# Altium project Open Reactor Control System.PrjPcb (part 1 of 2)
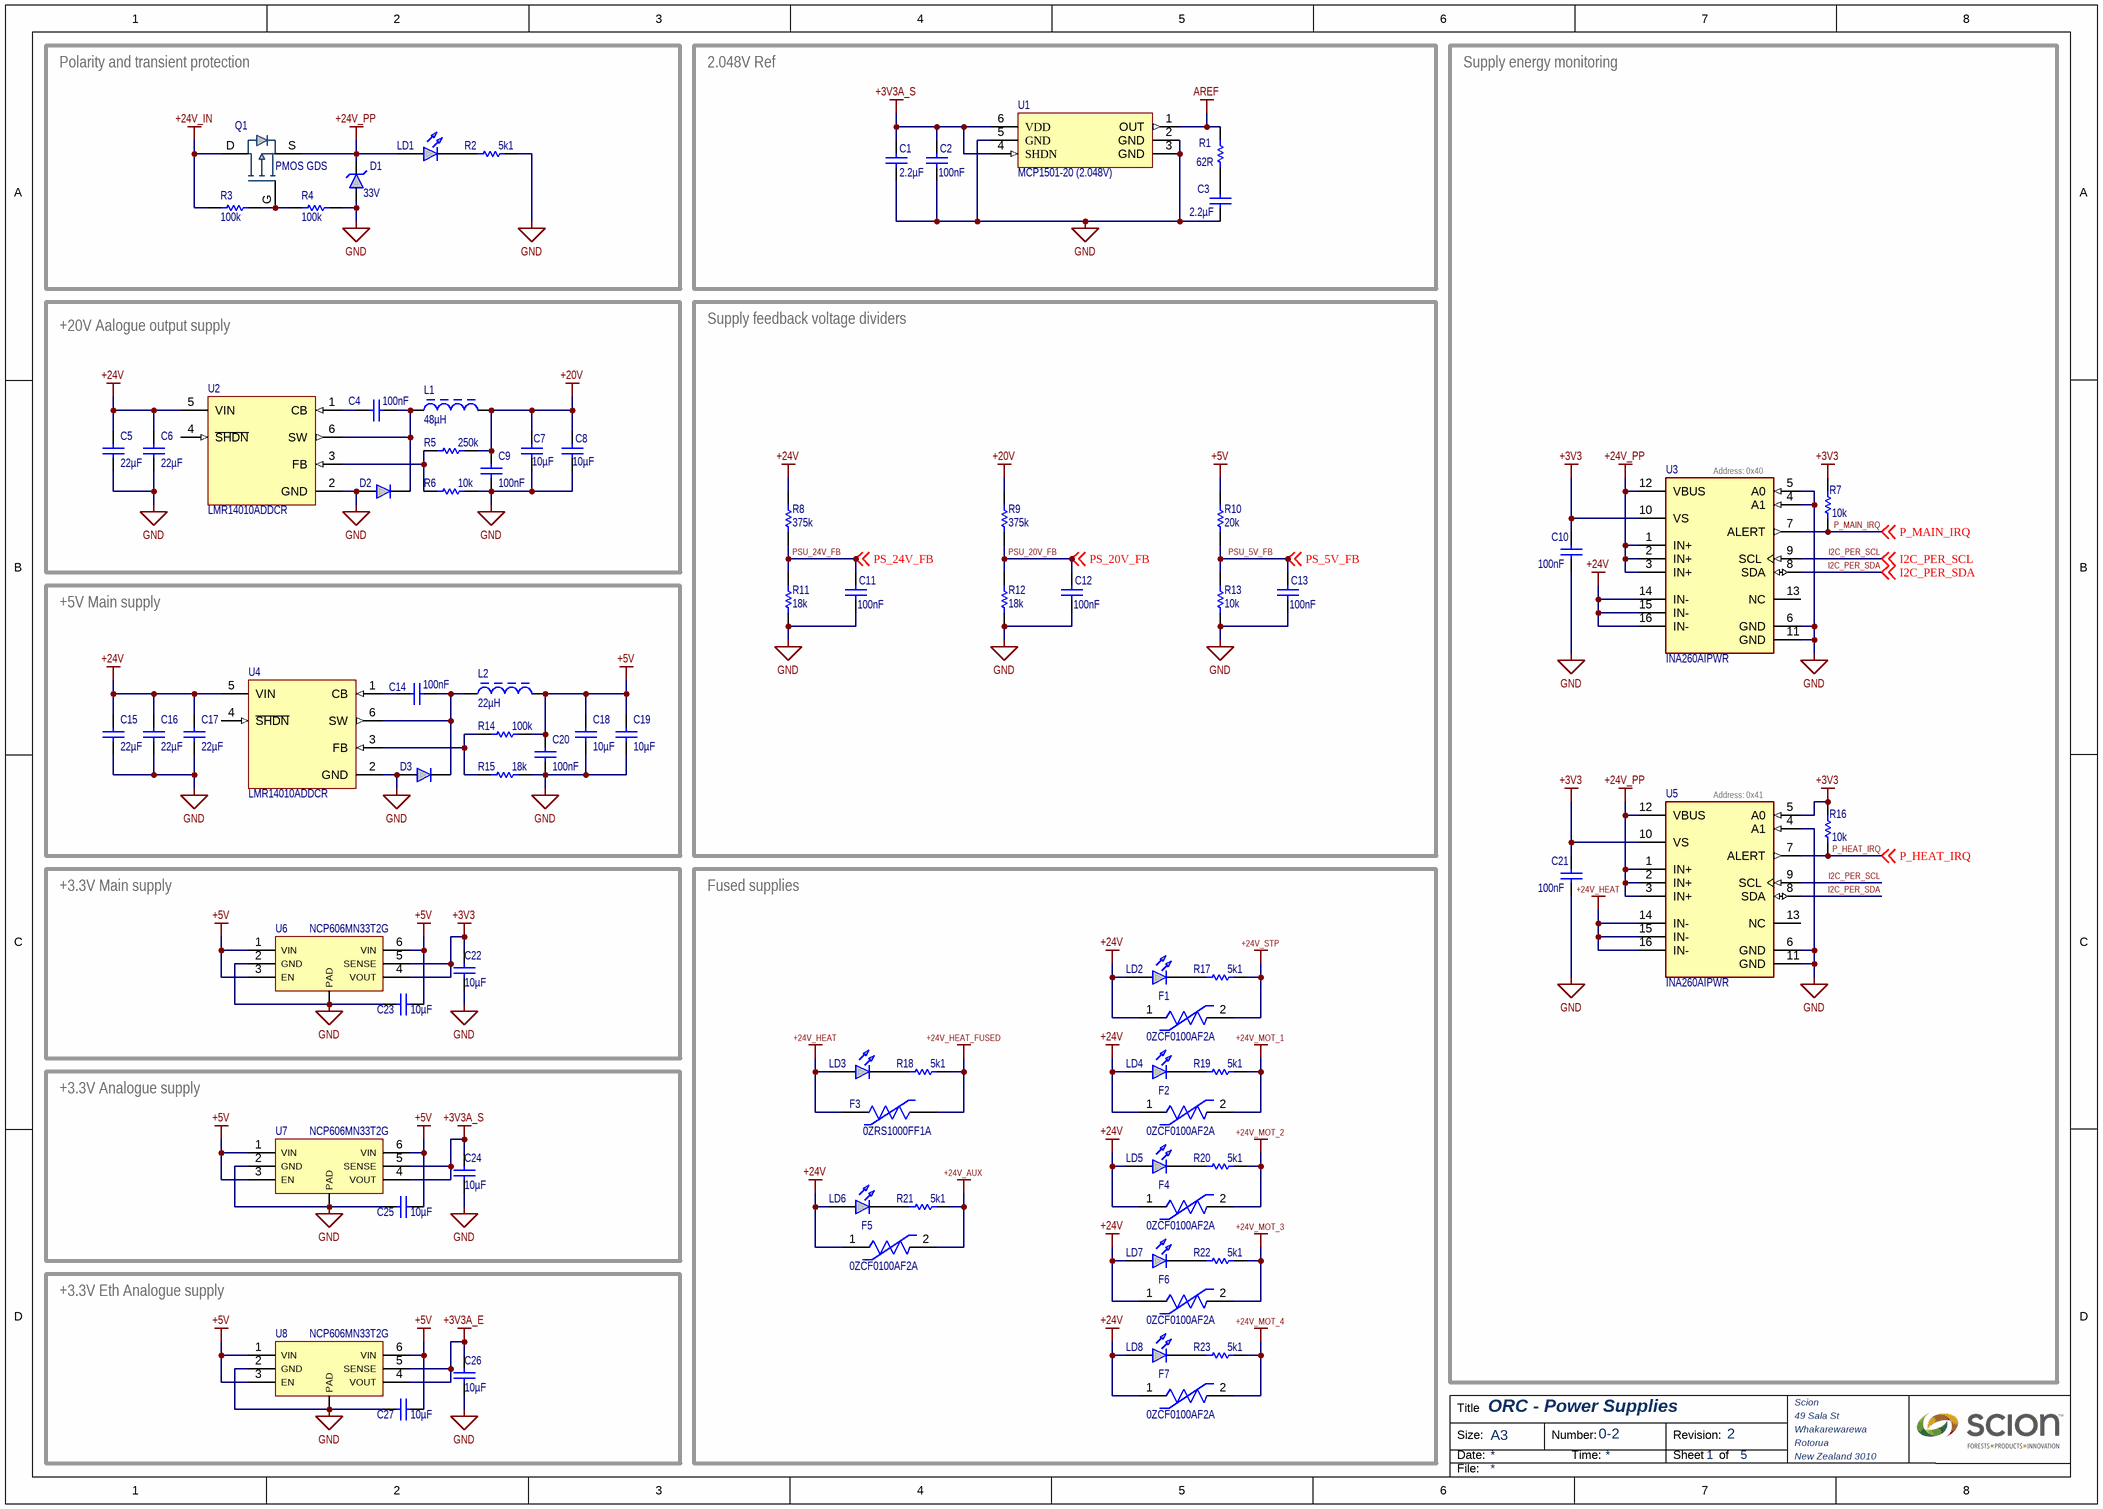
[diagram p0: Open Reactor Control System - Power Supplies.SchDoc]
5 sheets, 408 parts. Net scope: global (net labels, ports and power ports of the same name join across sheets).
Board file: Open Reactor Control System.PcbDoc
Sheets:
  Open Reactor Control System - Power Supplies.SchDoc
  Open Reactor Control System - System Interface MCU.SchDoc
  Open Reactor Control System - Machine Interface MCU.SchDoc
  Open Reactor Control System - Analogue & IO Interfaces.SchDoc
  Open Reactor Control System - IO Connections.SchDoc

## Sheet Open Reactor Control System - Power Supplies.SchDoc: ORC - Power Supplies
size A3; Author: Peake J; CompanyName: Scion Research; DrawnBy: Peake J; Engineer: Peake J; Organization: Scion; Address1: 49 Sala St; Address2: Whakarewarewa; Address3: Rotorua; Address4: New Zealand 3010; DocumentNumber: 0-2; Revision: 2; SheetNumber: 1; SheetTotal: 5

### Parts
C1  value 2.2µF  [0603_CAP]  (hidden comment: Capacitor)
C2  value 100nF  [0603_CAP]  (hidden comment: Capacitor)
C3  value 2.2µF  [0603_CAP]  (hidden comment: Capacitor)
C4  value 100nF  [0603_CAP]  (hidden comment: Capacitor)
C5  value 22µF  [1206_CAP]  (hidden comment: Capacitor)
C6  value 22µF  [1206_CAP]  (hidden comment: Capacitor)
C7  value 10µF  [1206_CAP]  (hidden comment: Capacitor)
C8  value 10µF  [1206_CAP]  (hidden comment: Capacitor)
C9  value 100nF  [0603_CAP]  (hidden comment: Capacitor)
C10  value 100nF  [0603_CAP]  (hidden comment: Capacitor)
C11  value 100nF  [0603_CAP]  (hidden comment: Capacitor)
C12  value 100nF  [0603_CAP]  (hidden comment: Capacitor)
C13  value 100nF  [0603_CAP]  (hidden comment: Capacitor)
C14  value 100nF  [0603_CAP]  (hidden comment: Capacitor)
C15  value 22µF  [1206_CAP]  (hidden comment: Capacitor)
C16  value 22µF  [1206_CAP]  (hidden comment: Capacitor)
C17  value 22µF  [1206_CAP]  (hidden comment: Capacitor)
C18  value 10µF  [0603_CAP]  (hidden comment: Capacitor)
C19  value 10µF  [0603_CAP]  (hidden comment: Capacitor)
C20  value 100nF  [0603_CAP]  (hidden comment: Capacitor)
C21  value 100nF  [0603_CAP]  (hidden comment: Capacitor)
C22  value 10µF  [0603_CAP]  (hidden comment: Capacitor)
C23  value 10µF  [0603_CAP]  (hidden comment: Capacitor)
C24  value 10µF  [0603_CAP]  (hidden comment: Capacitor)
C25  value 10µF  [0603_CAP]  (hidden comment: Capacitor)
C26  value 10µF  [0603_CAP]  (hidden comment: Capacitor)
C27  value 10µF  [0603_CAP]  (hidden comment: Capacitor)
D1  Rated Voltage: 33V  [SMBJ]  (hidden comment: Transil)
D2  Diode  [SOD-123]  (value not drawn)
D3  Diode  [SOD-123]  (value not drawn)
F1  0ZCF0100AF2A  [FP-0ZCF0100AF2A-MFG]
F2  0ZCF0100AF2A  [FP-0ZCF0100AF2A-MFG]
F3  0ZRS1000FF1A  [0ZRS1000FF1A-flat]
F4  0ZCF0100AF2A  [FP-0ZCF0100AF2A-MFG]
F5  0ZCF0100AF2A  [FP-0ZCF0100AF2A-MFG]
F6  0ZCF0100AF2A  [FP-0ZCF0100AF2A-MFG]
F7  0ZCF0100AF2A  [FP-0ZCF0100AF2A-MFG]
L1  value 48µH  [SRR1206]  (hidden comment: Inductor)
L2  value 22µH  [BOUR-SRN8040_V]  (hidden comment: Inductor)
LD1  LED  [0805]  (value not drawn)
LD2  LED  [0805]  (value not drawn)
LD3  LED  [0805]  (value not drawn)
LD4  LED  [0805]  (value not drawn)
LD5  LED  [0805]  (value not drawn)
LD6  LED  [0805]  (value not drawn)
LD7  LED  [0805]  (value not drawn)
LD8  LED  [0805]  (value not drawn)
Q1  PMOS GDS  [PowerDI 5060-8]
R1  value 62R  [0603_RES]  (hidden comment: Resistor)
R2  value 5k1  [0603_RES]  (hidden comment: Resistor)
R3  value 100k  [0603_RES]  (hidden comment: Resistor)
R4  value 100k  [0603_RES]  (hidden comment: Resistor)
R5  value 250k  [0603_RES]  (hidden comment: Resistor)
R6  value 10k  [0603_RES]  (hidden comment: Resistor)
R7  value 10k  [0603_RES]  (hidden comment: Resistor)
R8  value 375k  [0603_RES]  (hidden comment: Resistor)
R9  value 375k  [0603_RES]  (hidden comment: Resistor)
R10  value 20k  [0603_RES]  (hidden comment: Resistor)
R11  value 18k  [0603_RES]  (hidden comment: Resistor)
R12  value 18k  [0603_RES]  (hidden comment: Resistor)
R13  value 10k  [0603_RES]  (hidden comment: Resistor)
R14  value 100k  [0603_RES]  (hidden comment: Resistor)
R15  value 18k  [0603_RES]  (hidden comment: Resistor)
R16  value 10k  [0603_RES]  (hidden comment: Resistor)
R17  value 5k1  [0603_RES]  (hidden comment: Resistor)
R18  value 5k1  [0603_RES]  (hidden comment: Resistor)
R19  value 5k1  [0603_RES]  (hidden comment: Resistor)
R20  value 5k1  [0603_RES]  (hidden comment: Resistor)
R21  value 5k1  [0603_RES]  (hidden comment: Resistor)
R22  value 5k1  [0603_RES]  (hidden comment: Resistor)
R23  value 5k1  [0603_RES]  (hidden comment: Resistor)
U1  MCP1501-20 (2.048V)  [SOT-6]
U2  LMR14010ADDCR  [FP-DDC0006A-IPC_A]
U3  INA260AIPWR  [FP-PW0016A-IPC_B]
U4  LMR14010ADDCR  [FP-DDC0006A-IPC_A]
U5  INA260AIPWR  [FP-PW0016A-IPC_B]
U6  NCP606MN33T2G  [QFN95P330X295X100_HS-7N]
U7  NCP606MN33T2G  [QFN95P330X295X100_HS-7N]
U8  NCP606MN33T2G  [QFN95P330X295X100_HS-7N]

### Blocks framed on the sheet
Polarity and transient protection: D1 LD1 Q1 R2-R4
2.048V Ref: C1-C3 R1 U1
Supply energy monitoring: C10 C21 R7 R16 U3 U5
+20V Aalogue output supply: C4-C9 D2 L1 R5 R6 U2
Supply feedback voltage dividers: C11-C13 R8-R13
+5V Main supply: C14-C20 D3 L2 R14 R15 U4
+3.3V Main supply: C22 C23 U6
Fused supplies: F1-F7 LD2-LD8 R17-R23
+3.3V Analogue supply: C24 C25 U7
+3.3V Eth Analogue supply: C26 C27 U8

### Nets
+3V3: C10.1 C21.1 C22.1 R7.1 R16.1 U3.10(VS) U5.5(A0) U5.10(VS) U6.4(VOUT) U6.5(SENSE)
+3V3A_E: C26.1 U8.4(VOUT) U8.5(SENSE)
+3V3A_S: C1.1 C2.1 C24.1 U1.4(SHDN) U1.6(VDD) U7.4(VOUT) U7.5(SENSE)
+5V: C18.1 C19.1 C20.1 C23.1 C25.1 C27.1 L2.2 R10.1 R14.2 U6.1(VIN) U6.3(EN) U6.6(VIN) U7.1(VIN) U7.3(EN) U7.6(VIN) U8.1(VIN) U8.3(EN) U8.6(VIN)
+20V: C7.1 C8.1 C9.1 L1.2 R5.2 R9.1
+24V: C5.1 C6.1 C15.1 C16.1 C17.1 F1.1 F2.1 F4.1 F5.1 F6.1 F7.1 LD2.2(A) LD4.2(A) LD5.2(A) LD6.2(A) LD7.2(A) LD8.2(A) R8.1 U2.5(VIN) U3.14(IN-) U3.15(IN-) U3.16(IN-) U4.5(VIN)
+24V_AUX: F5.2 R21.2
+24V_HEAT: F3.1 LD3.2(A) U5.14(IN-) U5.15(IN-) U5.16(IN-)
+24V_HEAT_FUSED: F3.2 R18.2
+24V_IN: Q1.D R3.1
+24V_MOT_1: F2.2 R19.2
+24V_MOT_2: F4.2 R20.2
+24V_MOT_3: F6.2 R22.2
+24V_MOT_4: F7.2 R23.2
+24V_PP: D1.2(K) LD1.2(A) Q1.S U3.1(IN+) U3.2(IN+) U3.3(IN+) U3.12(VBUS) U5.1(IN+) U5.2(IN+) U5.3(IN+) U5.12(VBUS)
+24V_STP: F1.2 R17.2
AREF: R1.1 U1.1(OUT)
GND: C1.2 C2.2 C3.1 C5.2 C6.2 C7.2 C8.2 C9.2 C10.2 C11.2 C12.2 C13.2 C15.2 C16.2 C17.2 C18.2 C19.2 C20.2 C21.2 C22.2 C23.2 C24.2 C25.2 C26.2 C27.2 D1.1(A) D2.2(A) D3.2(A) R2.2 R4.2 R6.2 R11.1 R12.1 R13.1 R15.2 U1.2(GND) U1.3(GND) U1.5(GND) U2.2(GND) U3.4(A1) U3.5(A0) U3.6(GND) U3.11(GND) U4.2(GND) U5.4(A1) U5.6(GND) U5.11(GND) U6.2(GND) U6.PAD U7.2(GND) U7.PAD U8.2(GND) U8.PAD
I2C_PER_SCL: U3.9(SCL) U5.9(SCL) ; off-sheet I2C_PER_SCL
I2C_PER_SDA: U3.8(SDA) U5.8(SDA) ; off-sheet I2C_PER_SDA
P_HEAT_IRQ: R16.2 U5.7(ALERT) ; off-sheet P_HEAT_IRQ
P_MAIN_IRQ: R7.2 U3.7(ALERT) ; off-sheet P_MAIN_IRQ
PS_5V_FB: C13.1 R10.2 R13.2 ; off-sheet PS_5V_FB  [also labelled PSU_5V_FB]
PS_20V_FB: C12.1 R9.2 R12.2 ; off-sheet PS_20V_FB  [also labelled PSU_20V_FB]
PS_24V_FB: C11.1 R8.2 R11.2 ; off-sheet PS_24V_FB  [also labelled PSU_24V_FB]
NetC3_2: C3.2 R1.2
NetC4_1: C4.1 D2.1(K) L1.1 U2.6(SW)
NetC4_2: C4.2 U2.1(CB)
NetC14_1: C14.1 D3.1(K) L2.1 U4.6(SW)
NetC14_2: C14.2 U4.1(CB)
NetLD1_1: LD1.1(K) R2.1
NetLD2_1: LD2.1(K) R17.1
NetLD3_1: LD3.1(K) R18.1
NetLD4_1: LD4.1(K) R19.1
NetLD5_1: LD5.1(K) R20.1
NetLD6_1: LD6.1(K) R21.1
NetLD7_1: LD7.1(K) R22.1
NetLD8_1: LD8.1(K) R23.1
NetQ1_G: Q1.G R3.2 R4.1
NetR5_1: R5.1 R6.1 U2.3(FB)
NetR14_1: R14.1 R15.1 U4.3(FB)

Not connected (* = marked no-connect by the designer): U2 4(~{SHDN}); U3 13(NC); U4 4(~{SHDN}); U5 13(NC)

### Notes on the sheet
- (near U3) Address: 0x40
- (near U5) Address: 0x41
- Title
- Size:
- Date:
- A3
- Number:
- Time:
- Revision:
- Sheet
- of
- File:

### Library data of the parts
C1-C27 = CMP-001-00172-2: SMD Capacitor; Pins: 2; Source: Discrete.SchLib; Design Item ID: Capacitor; Component Type: Standard
D1 = CMP-079-000108-2: Transient Voltage Suppressor; MFN: SMBJ33A; Component Type: Standard; Pin Count: 2; Source: Discrete.SchLib; Breakdown Voltage: *; Design Item ID: Transil; Clamping Voltage: *
D2 D3 = CMP-004-00083-4: SMD Diode; Design Item ID: Diode; Pins: 2; Source: Discrete.SchLib; Component Type: Standard; Pin Count: 2
F1 F2 F4-F7 = CMP-005-00014-2: PTC Resettable Fuse 100A 0.5s 60VDC 0.09 Ohm 2-Pin 2920 T/R; Time to Trip: 500ms; Hold Current: 1A; Trip Current: 2A; Pins: 2; Component Type: Standard; Thickness: 0.067inch; Width: 0.202inch; Series: 0ZCF; Max Operating Temperature: 85°C; Source: All Components - 30.06.23 - 18.27.SchLib; Min Operating Temperature: -40°C; Design Item ID: CMP-00051-1; Length: 0.29inch; Case/Package: 2920; RoHS Compliant: Yes; Packaging: Cut Tape; Max Current Rating: 100A; Case Code (Metric): 7351; Mount: Surface Mount
F3 = CMP-005-00013-5: PTC Resettable Fuse 10A(hold) 20A(trip) 32VDC 100A 7W 15s 0.006Ohm Radial 23.5 X 4 X 27.9mm Box; Mount: Through Hole; Source: All Components - 30.06.23 - 18.27.SchLib; Trip Current: 20A; Component Type: Standard; Hold Current: 10A; Case/Package: Radial; Series: 0ZRS; Ratings: AEC-Q200; Time to Trip: 15s; Design Item ID: CMP-00049-1; Max Current Rating: 100A; Min Operating Temperature: -40°C; Pins: 2; Max Operating Temperature: 125°C
L1 L2 = CMP-006-00052-2: Power Inductor; DCR: 100mR; Current Rating: 2.2A; Pins: 2; Component Type: Standard; Design Item ID: Inductor; Source: Discrete.SchLib; Pin Count: 2; MFN: *
LD1-LD8 = CMP-004-00084-3: SMD LED; Colour: RED; Pins: 2; Source: Discrete.SchLib; Design Item ID: LED; Component Type: Standard; Pin Count: 2
Q1 = CMP-079-000102-2: P Channel MOSFET; MFN: *; Design Item ID: PMOS GDS; VGS Max: *; Continuous Current: *; VDS Breakdown: *; Source: P-MOS.SchLib; Component Type: Standard; Pin Count: 3
R1-R23 = CMP-009-00356-1: SMD Resistor; Pins: 2; Source: Discrete.SchLib; Component Type: Standard; Design Item ID: Resistor
U1 = CMP-079-000089-1: Voltage Reference; Pin Count: 6; Source: Microchip.SchLib; Component Type: Standard; Design Item ID: MCP1501
U2 U4 = CMP-079-000005-5: 7-40VDC-DC buck converter; Number of Outputs: 1; Max Output Voltage: 40V; Output Current: 1A; Min Input Voltage: 4V; Output Type: Adjustable; Synchronous Rectifier: No; Min Output Voltage: 765mV; Output Configuration: Positive; Switching Frequency: 850kHz; Max Operating Temperature: 125°C; Case/Package: SOT-23-6; Features: UVLO; Pin Count: 6; Packaging: Cut Tape; Mount: Surface Mount; Component Type: Standard; Min Operating Temperature: -40°C; Max Input Voltage: 40V; Source: All Components - 30.06.23 - 18.27.SchLib; Design Item ID: CMP-00007-1
U3 U5 = CMP-010-00002-1: Operational Amplifier, 1 Func, 7500uV Offset-Max, PDSO16; Max Supply Voltage: 5.5V; Nominal Supply Voltage: 3.3V; Min Supply Voltage: 2.7V; Case/Package: TSSOP; RoHS Compliant: Yes; Pins: 16; Max Operating Temperature: 125°C; Min Operating Temperature: -40°C
U6-U8 = CMP-019-00001-1: Fixed Positive LDO Regulator, 3.3V, 0.22V Dropout, CMOS; Max Supply Voltage: 6V; RoHS Compliant: Yes; Case/Package: HVSON; Pins: 6

## Sheet Open Reactor Control System - System Interface MCU.SchDoc: ORC - System Interface MCU
size A3; Author: Peake J; CompanyName: Scion Research; DrawnBy: Peake J; Engineer: Peake J; Organization: Scion; Address1: 49 Sala St; Address2: Whakarewarewa; Address3: Rotorua; Address4: New Zealand 3010; DocumentNumber: 0-3; Revision: 2; SheetNumber: 2; SheetTotal: 5
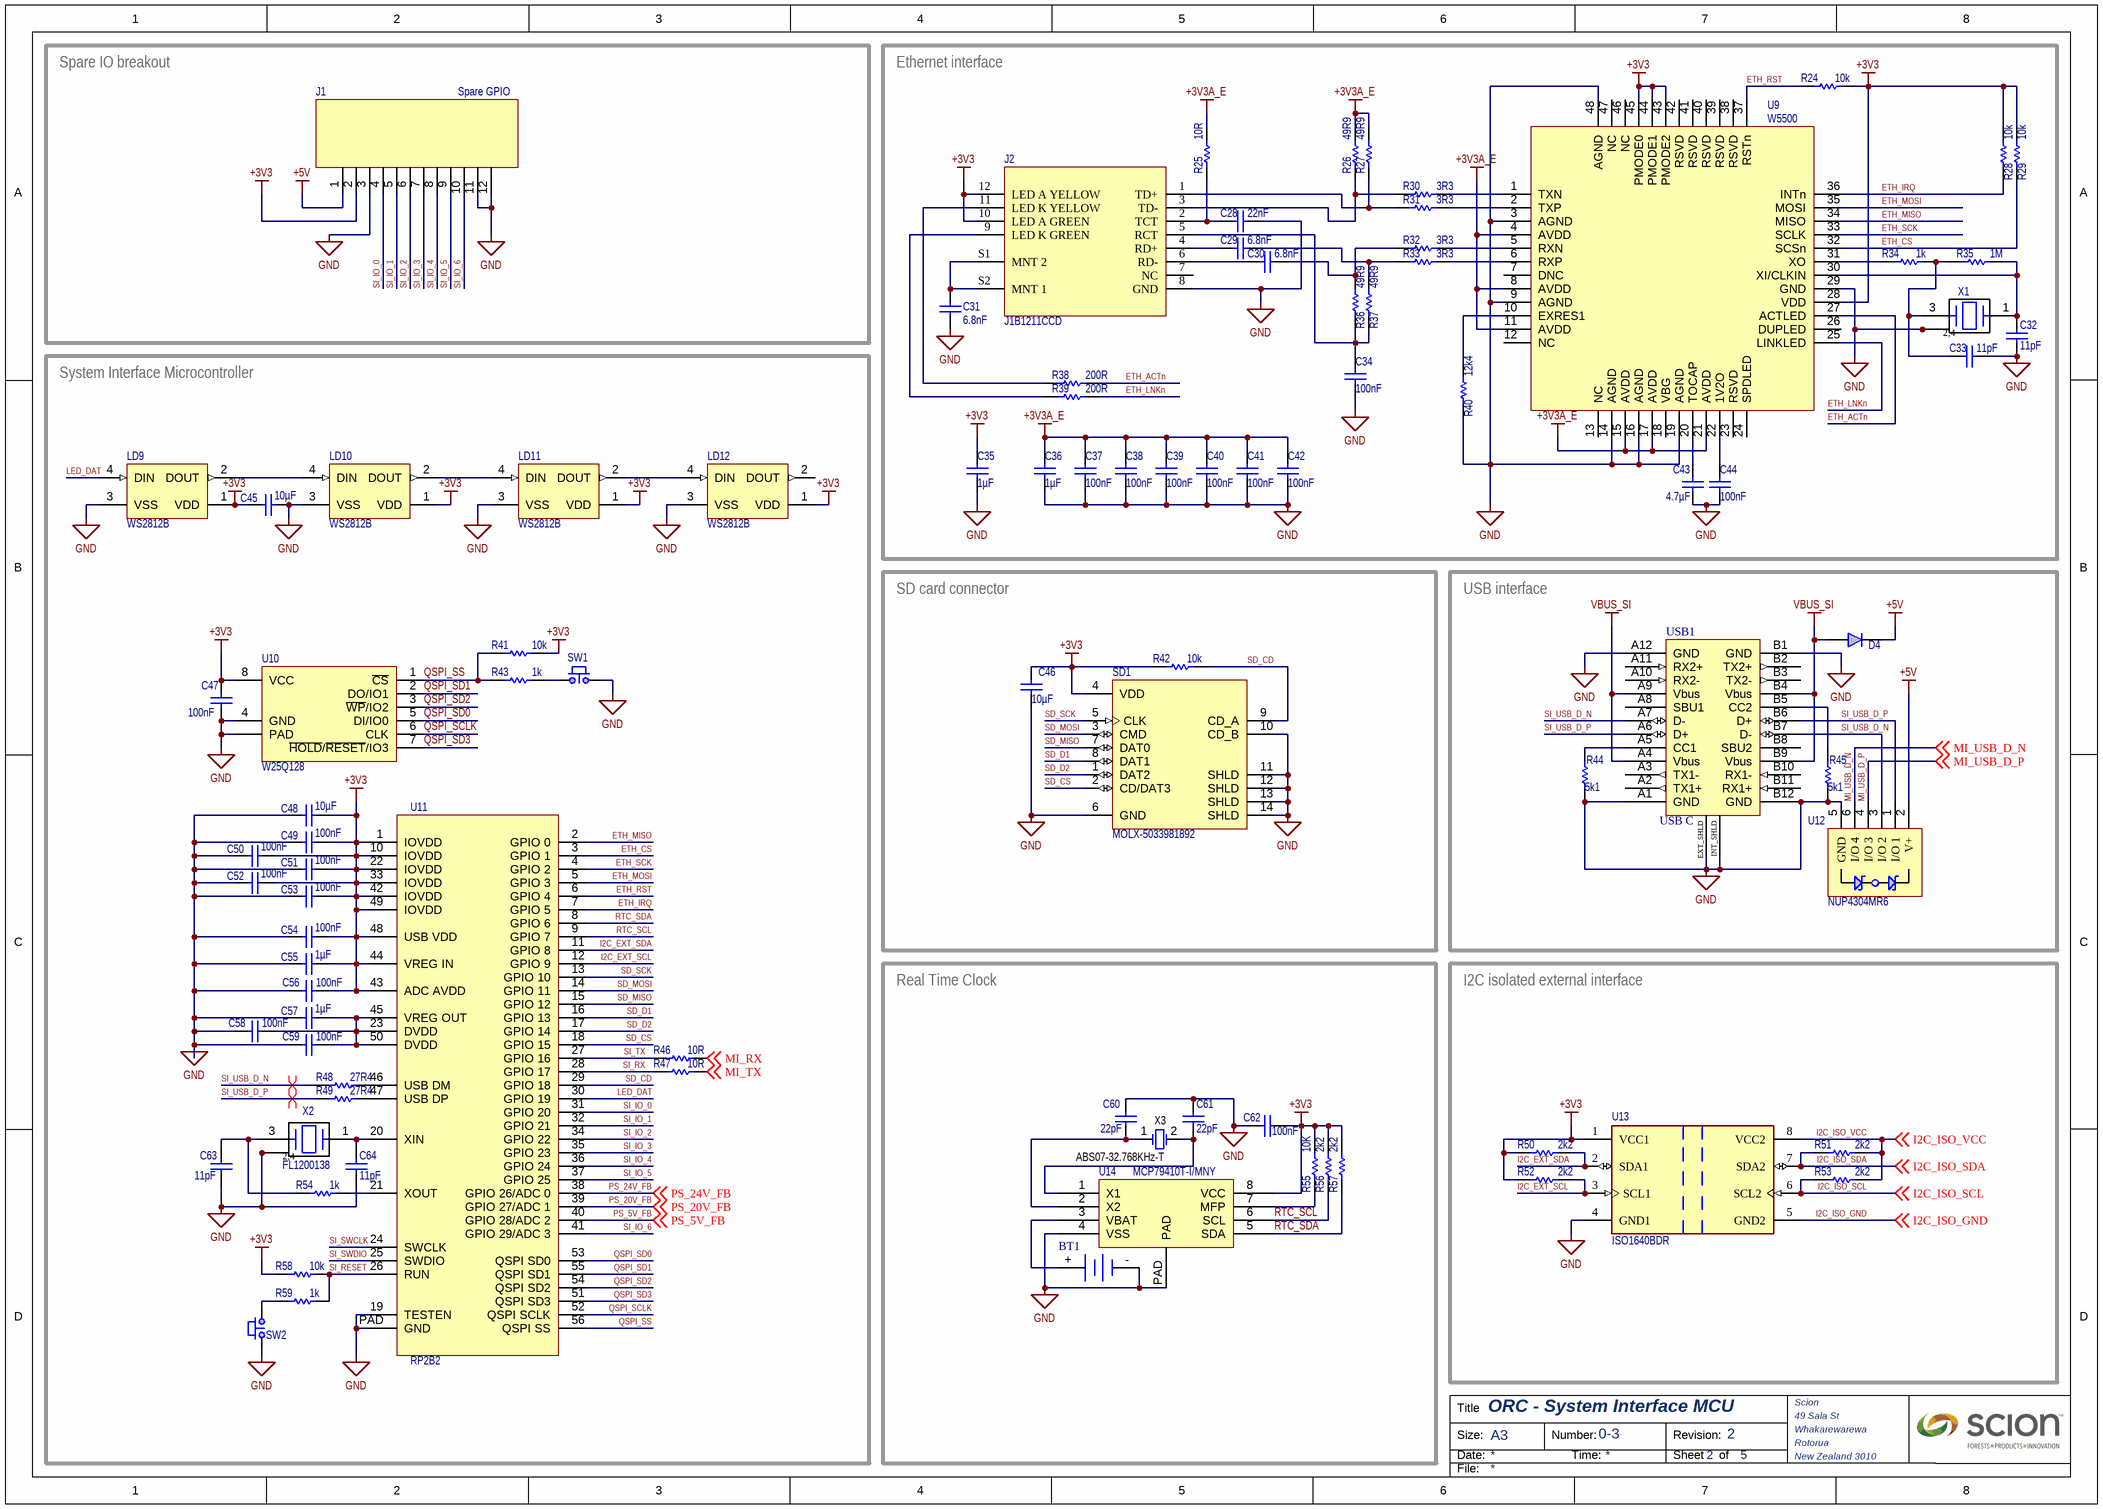
[diagram p1: Open Reactor Control System - System Interface MCU.SchDoc]

### Parts
BT1  CR2032 Batt Holder  [CR2032 Batt Holder-Footprint-1]  (value not drawn)
C28  value 22nF  [0603_CAP]  (hidden comment: Capacitor)
C29  value 6.8nF  [0603_CAP]  (hidden comment: Capacitor)
C30  value 6.8nF  [0603_CAP]  (hidden comment: Capacitor)
C31  value 6.8nF  [0603_CAP]  (hidden comment: Capacitor)
C32  value 11pF  [0603_CAP]  (hidden comment: Capacitor)
C33  value 11pF  [0603_CAP]  (hidden comment: Capacitor)
C34  value 100nF  [0603_CAP]  (hidden comment: Capacitor)
C35  value 1µF  [0402_CAP]  (hidden comment: Capacitor)
C36  value 1µF  [0402_CAP]  (hidden comment: Capacitor)
C37  value 100nF  [0402_CAP]  (hidden comment: Capacitor)
C38  value 100nF  [0402_CAP]  (hidden comment: Capacitor)
C39  value 100nF  [0402_CAP]  (hidden comment: Capacitor)
C40  value 100nF  [0402_CAP]  (hidden comment: Capacitor)
C41  value 100nF  [0402_CAP]  (hidden comment: Capacitor)
C42  value 100nF  [0402_CAP]  (hidden comment: Capacitor)
C43  value 4.7µF  [0603_CAP]  (hidden comment: Capacitor)
C44  value 100nF  [0402_CAP]  (hidden comment: Capacitor)
C45  value 10µF  [0603_CAP]  (hidden comment: Capacitor)
C46  value 10µF  [0603_CAP]  (hidden comment: Capacitor)
C47  value 100nF  [0603_CAP]  (hidden comment: Capacitor)
C48  value 10µF  [0603_CAP]  (hidden comment: Capacitor)
C49  value 100nF  [0402_CAP]  (hidden comment: Capacitor)
C50  value 100nF  [0402_CAP]  (hidden comment: Capacitor)
C51  value 100nF  [0402_CAP]  (hidden comment: Capacitor)
C52  value 100nF  [0402_CAP]  (hidden comment: Capacitor)
C53  value 100nF  [0402_CAP]  (hidden comment: Capacitor)
C54  value 100nF  [0402_CAP]  (hidden comment: Capacitor)
C55  value 1µF  [0402_CAP]  (hidden comment: Capacitor)
C56  value 100nF  [0402_CAP]  (hidden comment: CMP-001-00172-2)
C57  value 1µF  [0402_CAP]  (hidden comment: Capacitor)
C58  value 100nF  [0402_CAP]  (hidden comment: CMP-001-00172-2)
C59  value 100nF  [0402_CAP]  (hidden comment: CMP-001-00172-2)
C60  value 22pF  [0603_CAP]  (hidden comment: Capacitor)
C61  value 22pF  [0603_CAP]  (hidden comment: Capacitor)
C62  value 100nF  [0603_CAP]  (hidden comment: Capacitor)
C63  value 11pF  [0603_CAP]  (hidden comment: Capacitor)
C64  value 11pF  [0603_CAP]  (hidden comment: Capacitor)
D4  Diode  [SOD-123]  (value not drawn)
J1  Spare GPIO  [12P DIP 2.54mm male header]
J2  J1B1211CCD  [FP-J1B1211CCD-MFG]
LD9  WS2812B  [WS2812B-2020]
LD10  WS2812B  [WS2812B-2020]
LD11  WS2812B  [WS2812B-2020]
LD12  WS2812B  [WS2812B-2020]
R24  value 10k  [0603_RES]  (hidden comment: Resistor)
R25  value 10R  [0603_RES]  (hidden comment: Resistor)
R26  value 49R9  [0603_RES]  (hidden comment: Resistor)
R27  value 49R9  [0603_RES]  (hidden comment: Resistor)
R28  value 10k  [0603_RES]  (hidden comment: Resistor)
R29  value 10k  [0603_RES]  (hidden comment: Resistor)
R30  value 3R3  [0603_RES]  (hidden comment: Resistor)
R31  value 3R3  [0603_RES]  (hidden comment: Resistor)
R32  value 3R3  [0603_RES]  (hidden comment: Resistor)
R33  value 3R3  [0603_RES]  (hidden comment: Resistor)
R34  value 1k  [0603_RES]  (hidden comment: Resistor)
R35  value 1M  [0603_RES]  (hidden comment: Resistor)
R36  value 49R9  [0603_RES]  (hidden comment: Resistor)
R37  value 49R9  [0603_RES]  (hidden comment: Resistor)
R38  value 200R  [0603_RES]  (hidden comment: Resistor)
R39  value 200R  [0603_RES]  (hidden comment: Resistor)
R40  value 12k4  [0603_RES]  (hidden comment: Resistor)
R41  value 10k  [0603_RES]  (hidden comment: Resistor)
R42  value 10k  [0603_RES]  (hidden comment: Resistor)
R43  value 1k  [0603_RES]  (hidden comment: Resistor)
R44  value 5k1  [0603_RES]  (hidden comment: Resistor)
R45  value 5k1  [0603_RES]  (hidden comment: Resistor)
R46  value 10R  [0603_RES]  (hidden comment: Resistor)
R47  value 10R  [0603_RES]  (hidden comment: Resistor)
R48  value 27R4  [0603_RES]  (hidden comment: Resistor)
R49  value 27R4  [0603_RES]  (hidden comment: Resistor)
R50  value 2k2  [0603_RES]  (hidden comment: Resistor)
R51  value 2k2  [0603_RES]  (hidden comment: Resistor)
R52  value 2k2  [0603_RES]  (hidden comment: Resistor)
R53  value 2k2  [0603_RES]  (hidden comment: Resistor)
R54  value 1k  [0603_RES]  (hidden comment: Resistor)
R55  value 10K  [0603_RES]  (hidden comment: Resistor)
R56  value 2k2  [0603_RES]  (hidden comment: Resistor)
R57  value 2k2  [0603_RES]  (hidden comment: Resistor)
R58  value 10k  [0603_RES]  (hidden comment: Resistor)
R59  value 1k  [0603_RES]  (hidden comment: Resistor)
SD1  MOLX-5033981892  [MOLX-5033981892_V]
SW1  EVP-AAN02Q  [FP-EVP-AAN02Q-MFG]  (value not drawn)
SW2  EVP-AAN02Q  [FP-EVP-AAN02Q-MFG]  (value not drawn)
U9  W5500  [TSQFP50P900X900X160-48N]
U10  W25Q128  [SOIC127P790X216-8N]
U11  RP2B2  [QFN40P700X700X90_HS-57N]
U12  NUP4304MR6  [TSOP-6]
U13  ISO1640BDR  [FP-D0008A-IPC_B]
U14  MCP79410T-I/MNY  [MCP79410T-I_MNY-Footprint-1]
USB1  USB C  [GT-USB-7010ASV]
X1  ABM8-25.000MHZ-12-D1X-T  [3225 CRYSTAL 12MHz]  (value not drawn)
X2  FL1200138  [3225 CRYSTAL 12MHz]
X3  ABS07-32.768KHz-T  [ABRA-ABS07-2_V]

### Blocks framed on the sheet
Spare IO breakout: J1
Ethernet interface: C28-C44 J2 R24-R40 U9 X1
System Interface Microcontroller: C45 C47-C59 C63 C64 LD9-LD12 R41 R43 R46-R49 R54 R58 R59 SW1 SW2 U10 U11 X2
SD card connector: C46 R42 SD1
USB interface: D4 R44 R45 U12 USB1
Real Time Clock: BT1 C60-C62 R55-R57 U14 X3
I2C isolated external interface: R50-R53 U13

### Nets
+3V3: C35.2 C45.2 C46.1 C47.1 C48.1 C49.1 C50.1 C51.1 C52.1 C53.1 C54.1 C55.1 C56.2 C62.1 J1.2 J2.10(LED_A_GREEN) J2.12(LED_A_YELLOW) LD9.1(VDD) LD10.1(VDD) LD11.1(VDD) LD12.1(VDD) R24.2 R28.2 R29.2 R41.2 R42.2 R50.2 R52.2 R55.2 R56.1 R57.1 R58.2 SD1.4(VDD) U9.28(VDD) U9.43(PMODE2) U9.44(PMODE1) U9.45(PMODE0) U10.8(VCC) U11.1(IOVDD) U11.10(IOVDD) U11.22(IOVDD) U11.33(IOVDD) U11.42(IOVDD) U11.43(ADC_AVDD) U11.44(VREG_IN) U11.48(USB_VDD) U11.49(IOVDD) U13.1(VCC1) U14.8(VCC)
+3V3A_E: C36.2 C37.2 C38.2 C39.2 C40.2 C41.2 C42.2 R25.2 R26.2 R27.2 U9.4(AVDD) U9.8(AVDD) U9.11(AVDD) U9.15(AVDD) U9.17(AVDD) U9.21(AVDD)
+5V: D4.1(K) J1.1 U12.2(V+)
GND: BT1.- C28.1 C31.2 C32.2 C33.2 C34.1 C35.1 C36.1 C37.1 C38.1 C39.1 C40.1 C41.1 C42.1 C43.1 C44.1 C45.1 C46.2 C47.2 C48.2 C49.2 C50.2 C51.2 C52.2 C53.2 C54.2 C55.2 C56.1 C57.2 C58.1 C59.1 C60.2 C61.2 C62.2 C63.2 C64.2 J1.3 J1.11 J1.12 J2.8(GND) LD9.3(VSS) LD10.3(VSS) LD11.3(VSS) LD12.3(VSS) R40.1 R44.2 R45.2 SD1.6(GND) SD1.10(CD_B) SD1.11(SHLD) SD1.12(SHLD) SD1.13(SHLD) SD1.14(SHLD) SW1.2 SW2.1 U9.3(AGND) U9.9(AGND) U9.14(AGND) U9.16(AGND) U9.19(AGND) U9.29(GND) U9.48(AGND) U10.4(GND) U10.PAD U11.19(TESTEN) U11.PAD(GND) U12.5(GND) U13.4(GND1) U14.4(VSS) U14.PAD USB1.A1(GND) USB1.A12(GND) USB1.B1(GND) USB1.B12(GND) USB1.EXT_SHLD USB1.INT_SHLD X1.2(GND) X1.4(GND) X2.2(GND) X2.4(GND)
VBUS_SI: D4.2(A) USB1.A4(Vbus) USB1.A9(Vbus) USB1.B4(Vbus) USB1.B9(Vbus)
ETH_ACTn: R38.2 U9.27(ACTLED)
ETH_CS: R29.1 U9.32(SCSn) U11.3(GPIO_1)
ETH_IRQ: R28.1 U9.36(INTn) U11.7(GPIO_5)
ETH_LNKn: R39.2 U9.25(LINKLED)
ETH_MISO: U9.34(MISO) U11.2(GPIO_0)
ETH_MOSI: U9.35(MOSI) U11.5(GPIO_3)
ETH_RST: R24.1 U9.37(RSTn) U11.6(GPIO_4)
ETH_SCK: U9.33(SCLK) U11.4(GPIO_2)
I2C_EXT_SCL: R52.1 U11.12(GPIO_9) U13.3(SCL1)
I2C_EXT_SDA: R50.1 U11.11(GPIO_8) U13.2(SDA1)
I2C_ISO_GND: U13.5(GND2) ; off-sheet I2C_ISO_GND
I2C_ISO_SCL: R53.2 U13.6(SCL2) ; off-sheet I2C_ISO_SCL
I2C_ISO_SDA: R51.2 U13.7(SDA2) ; off-sheet I2C_ISO_SDA
I2C_ISO_VCC: R51.1 R53.1 U13.8(VCC2) ; off-sheet I2C_ISO_VCC
LED_DAT: LD9.4(DIN) U11.30(GPIO_19)
MI_RX: R46.1 ; off-sheet MI_RX
MI_TX: R47.1 ; off-sheet MI_TX
MI_USB_D_N: U12.6(I/O_4) ; off-sheet MI_USB_D_N
MI_USB_D_P: U12.4(I/O_3) ; off-sheet MI_USB_D_P
PS_5V_FB: U11.40(GPIO_28/ADC_2) ; off-sheet PS_5V_FB
PS_20V_FB: U11.39(GPIO_27/ADC_1) ; off-sheet PS_20V_FB
PS_24V_FB: U11.38(GPIO_26/ADC_0) ; off-sheet PS_24V_FB
QSPI_SCLK: U10.6(CLK) U11.52(QSPI_SCLK)
QSPI_SD0: U10.5(DI/IO0) U11.53(QSPI_SD0)
QSPI_SD1: U10.2(DO/IO1) U11.55(QSPI_SD1)
QSPI_SD2: U10.3(~{WP}/IO2) U11.54(QSPI_SD2)
QSPI_SD3: U10.7(~{HOLD}/~{RESET}/IO3) U11.51(QSPI_SD3)
QSPI_SS: R41.1 R43.2 U10.1(~{CS}) U11.56(QSPI_SS)
RTC_SCL: R56.2 U11.9(GPIO_7) U14.6(SCL)
RTC_SDA: R57.2 U11.8(GPIO_6) U14.5(SDA)
SD_CD: R42.1 SD1.9(CD_A) U11.29(GPIO_18)
SD_CS: SD1.2(CD/DAT3) U11.18(GPIO_15)
SD_D1: SD1.8(DAT1) U11.16(GPIO_13)
SD_D2: SD1.1(DAT2) U11.17(GPIO_14)
SD_MISO: SD1.7(DAT0) U11.15(GPIO_12)
SD_MOSI: SD1.3(CMD) U11.14(GPIO_11)
SD_SCK: SD1.5(CLK) U11.13(GPIO_10)
SI_IO_0: J1.4 U11.31(GPIO_20)
SI_IO_1: J1.5 U11.32(GPIO_21)
SI_IO_2: J1.6 U11.34(GPIO_22)
SI_IO_3: J1.7 U11.35(GPIO_23)
SI_IO_4: J1.8 U11.36(GPIO_24)
SI_IO_5: J1.9 U11.37(GPIO_25)
SI_IO_6: J1.10 U11.41(GPIO_29/ADC_3)
SI_RESET: R58.1 R59.1 U11.26(RUN)
SI_RX: R47.2 U11.28(GPIO_17)
SI_SWCLK: U11.24(SWCLK)
SI_SWDIO: U11.25(SWDIO)
SI_TX: R46.2 U11.27(GPIO_16)
SI_USB_D_N: R48.1 U12.3(I/O_2) USB1.A7(D-) USB1.B7(D-)
SI_USB_D_P: R49.1 U12.1(I/O_1) USB1.A6(D+) USB1.B6(D+)
NetBT1_+: BT1.+ U14.3(VBAT)
NetC28_2: C28.2 J2.2(TCT) R25.1
NetC29_1: C29.1 R33.1 R37.2
NetC29_2: C29.2 J2.4(RD+)
NetC30_1: C30.1 R32.1 R36.2
NetC30_2: C30.2 J2.6(RD-)
NetC31_1: C31.1 J2.S1(MNT_2) J2.S2(MNT_1)
NetC32_1: C32.1 R35.2 U9.30(XI/CLKIN) X1.1(XT)
NetC33_1: C33.1 R34.2 R35.1 X1.3(XT)
NetC34_2: C34.2 J2.5(RCT) R36.1 R37.1
NetC43_2: C43.2 U9.20(TOCAP)
NetC44_2: C44.2 U9.22(1V2O)
NetC57_1: C57.1 C58.2 C59.2 U11.23(DVDD) U11.45(VREG_OUT) U11.50(DVDD)
NetC60_1: C60.1 U14.2(X2) X3.1(OSC1)
NetC61_1: C61.1 U14.1(X1) X3.2(OSC2)
NetC63_1: C63.1 R54.1 X2.3(XT)
NetC64_1: C64.1 U11.20(XIN) X2.1(XT)
NetJ2_1: J2.1(TD+) R27.1 R31.1
NetJ2_3: J2.3(TD-) R26.1 R30.1
NetJ2_9: J2.9(LED_K_GREEN) R39.1
NetJ2_11: J2.11(LED_K_YELLOW) R38.1
NetLD9_2: LD9.2(DOUT) LD10.4(DIN)
NetLD10_2: LD10.2(DOUT) LD11.4(DIN)
NetLD11_2: LD11.2(DOUT) LD12.4(DIN)
NetR30_2: R30.2 U9.1(TXN)
NetR31_2: R31.2 U9.2(TXP)
NetR32_2: R32.2 U9.5(RXN)
NetR33_2: R33.2 U9.6(RXP)
NetR34_1: R34.1 U9.31(XO)
NetR40_2: R40.2 U9.10(EXRES1)
NetR43_1: R43.1 SW1.1
NetR44_1: R44.1 USB1.A5(CC1)
NetR45_1: R45.1 USB1.B5(CC2)
NetR48_2: R48.2 U11.46(USB_DM)
NetR49_2: R49.2 U11.47(USB_DP)
NetR54_2: R54.2 U11.21(XOUT)
NetR55_1: R55.1 U14.7(MFP)
NetR59_2: R59.2 SW2.2

Not connected (* = marked no-connect by the designer): J2 7(NC); LD12 2(DOUT); U9 7(DNC) 12(NC) 13(NC) 18(VBG) 23(RSVD) 24(SPDLED) 26(DUPLED) 38(RSVD) 39(RSVD) 40(RSVD) 41(RSVD) 42(RSVD) 46(NC) 47(NC); USB1 A2(TX1+) A3(TX1-) A8(SBU1) A10(RX2-) A11(RX2+) B2(TX2+) B3(TX2-) B8(SBU2) B10(RX1-) B11(RX1+)

### Layout directives
differential pair: SI_USB_D_N, SI_USB_D_P

### Notes on the sheet
- Title
- Size:
- Date:
- A3
- Number:
- Time:
- Revision:
- Sheet
- of
- File:
- (in symbol CMP-003-00068-2) 2,4

### Library data of the parts
BT1 = CMP-079-000035-3: SMD CR2032 coin cell holder; Component Type: Standard; Pin Count: 2; Source: All Components - 30.06.23 - 18.27.SchLib; Design Item ID: CMP-00042-2
C28-C59 C63 C64 = CMP-001-00172-2: SMD Capacitor; Pins: 2; Source: Discrete.SchLib; Design Item ID: Capacitor; Component Type: Standard
C60-C62 = CMP-001-00172-1: SMD Capacitor; Pins: 2; Source: Discrete.SchLib; Component Type: Standard; Design Item ID: Capacitor
D4 = CMP-004-00083-4: SMD Diode; Design Item ID: Diode; Pins: 2; Source: Discrete.SchLib; Component Type: Standard; Pin Count: 2
J1 = CMP-002-00171-6: 12 Pin Connector; Design Item ID: 12_Pin; Source: Connectors.SchLib; Component Type: Standard; Pins: 12; Pin Count: 12
J2 = CMP-002-00002-1: Telecom and Datacom Connector, 8 Contact(s), Female, Right Angle, Solder Terminal, Locking
LD9-LD12 = CMP-079-000113-2: Intelligent Control LED Integrated Light Source, 3.5 to 5.3 V, -25 to 80 degC, 4-Pin SMD, RoHS, Bulk; Manufacturer: Adafruit Industries; Mounting Technology: SM; RoHS Compliant: False; Package Reference: WS2812B; Case/Package: WS2812B; Component Type: Standard; Manufacturer URL: https://www.adafruit.com/; Package Description: 4-Pin Surface Mount Device, Body 5 x 5 mm, Pitch 3.3 mm; Source: All Components - 30.06.23 - 18.27.SchLib; Datasheet Version: May-13; Datasheet URL: https://cdn-shop.adafruit.com/datasheets/WS2812B.pdf; Pin Count: 4; Design Item ID: CMP-007-00035-3
R24-R37 R40-R43 R46 R47 R50-R59 = CMP-009-00356-1: SMD Resistor; Pins: 2; Source: Discrete.SchLib; Component Type: Standard; Design Item ID: Resistor
R38 R39 = CMP-009-00356-1: SMD Resistor; Value: 200R; Pins: 2; Source: Discrete.SchLib; Component Type: Standard; Design Item ID: Resistor
R44 R45 = CMP-009-00356-1: SMD Resistor; Value: 5k1; Pins: 2; Source: Discrete.SchLib; Component Type: Standard; Design Item ID: Resistor
R48 R49 = CMP-009-00356-1: SMD Resistor; Value: 27R4; Pins: 2; Source: Discrete.SchLib; Component Type: Standard; Design Item ID: Resistor
SD1 = CMP-079-000062-1: Micro SD Card Connector, Pitch 1.1 mm, 8 Position, Height 1.4 mm, -25 to 85 degC, RoHS, Tape and Reel; Source: All Components - 30.06.23 - 18.27.SchLib; Pins: 14; Design Item ID: CMP-002-00049-5; Component Type: Standard; Pin Count: 14
SW1 SW2 = CMP-011-00000-2: Switch Tactile N.O. SPST Rectangular Button J-Bend 0.02A 15VDC 100000Cycles 5N SMD T/R
U9 = CMP-015-00003-1: Microprocessor Circuit, CMOS, PQFP48; Max Supply Voltage: 3.63V; Nominal Supply Voltage: 3.3V; Min Supply Voltage: 2.97V; Case/Package: LFQFP; Max Operating Temperature: 85°C; Pins: 48; RoHS Compliant: Yes; Min Operating Temperature: -40°C
U10 = CMP-019-00000-2: W25Q16-256 SPI flash module
U11 = CMP-020-00000-3: RP2040 Arm Cortex M0+ Dual Core MCU
U12 = CMP-079-000096-2: ESD Protection Doide Array; Design Item ID: NUP4304MR6; Pin Count: 6; Component Type: Standard; Source: ON Semi.SchLib
U13 = CMP-015-00009-1: Interface Circuit, PDSO8; RoHS Compliant: Yes
U14 = CMP-00029-00016-2: Real Time Clock Serial 64byte Clock/Calendar/Alarm/Battery Backup Automotive 8-Pin TDFN EP T/R; Max Supply Voltage: 5.5V; Min Supply Voltage: 1.8V; Interface: I2C,Serial,2-Wire; Time Format: HH:MM:SS; Memory Size: 64B; Date Format: YY-MM-DD-dd; Lead Free: Lead Free; Case/Package: DFN; Weight: 0.001319oz; Length: 0.078inch; Max Operating Temperature: 85°C; Radiation Hardening: No; Packaging: Tape and Reel; Mount: Surface Mount; Package Quantity: 3300; Width: 0.118inch; Supply Voltage-Nom: 5.5V; Height: 0.03inch; Min Operating Temperature: -40°C; Logic Function: Clock; RoHS Compliant: Yes; Design Item ID: CMP-00046-1; Component Type: Standard; Source: All Components - 30.06.23 - 18.27.SchLib; Pins: 8; Pin Count: 9
USB1 = CMP-079-000004-4: Vertical or RA Type C Usb Connector Rohs Compliant: Yes; Pin Count: 26; Design Item ID: CMP-00005-5; Source: All Components - 30.06.23 - 18.27.SchLib; Component Type: Standard
X1 X2 = CMP-003-00068-2: SMD Crystal; Design Item ID: Crystal; Pins: 4; Component Type: Standard; Source: Discrete.SchLib
X3 = CMP-003-00061-3: Low Profile Crystal, 32.768 kHz, +/- 20 ppm, 12.5 pF, -40 to 85 degC, 2-Pin SMD, Pb-Free, Tape and Reel; Manufacturer: Abracon; Tolerance: 20ppm; Load Capacitance: 12.5pF; ESR: 70k; Case/Package: CSMD; Datasheet Version: Aug-15; Pins: 2; Max Operating Temperature: 85°C; Package Description: 2-Pin Surface Mount Device, Body 3.2 x 1.5 mm; Manufacturer URL: http://www.abracon.com/; Package URL: http://www.abracon.com/Support/PackageDrawing/Resonators/ABS07.PDF; Min Operating Temperature: -40°C; Packaging: TapeandReel; RoHS Compliant: True; Package Reference: ABS07-2; Frequency Tolerance: 20ppm; Frequency: 32.768kHz; Datasheet URL: http://www.abracon.com/Resonators/ABS07.pdf; Package Quantity: 3000; Mounting Technology: SM; Component Type: Standard; Source: All Components - 30.06.23 - 18.27.SchLib; Design Item ID: CMP-003-00022-1

## Sheet Open Reactor Control System - Machine Interface MCU.SchDoc: ORC - Machine Interface MCU
size A3; Author: Peake J; CompanyName: Scion Research; DrawnBy: Peake J; Engineer: Peake J; Organization: Scion; Address1: 49 Sala St; Address2: Whakarewarewa; Address3: Rotorua; Address4: New Zealand 3010; DocumentNumber: 0-4; Revision: 0; SheetNumber: 3; SheetTotal: 5
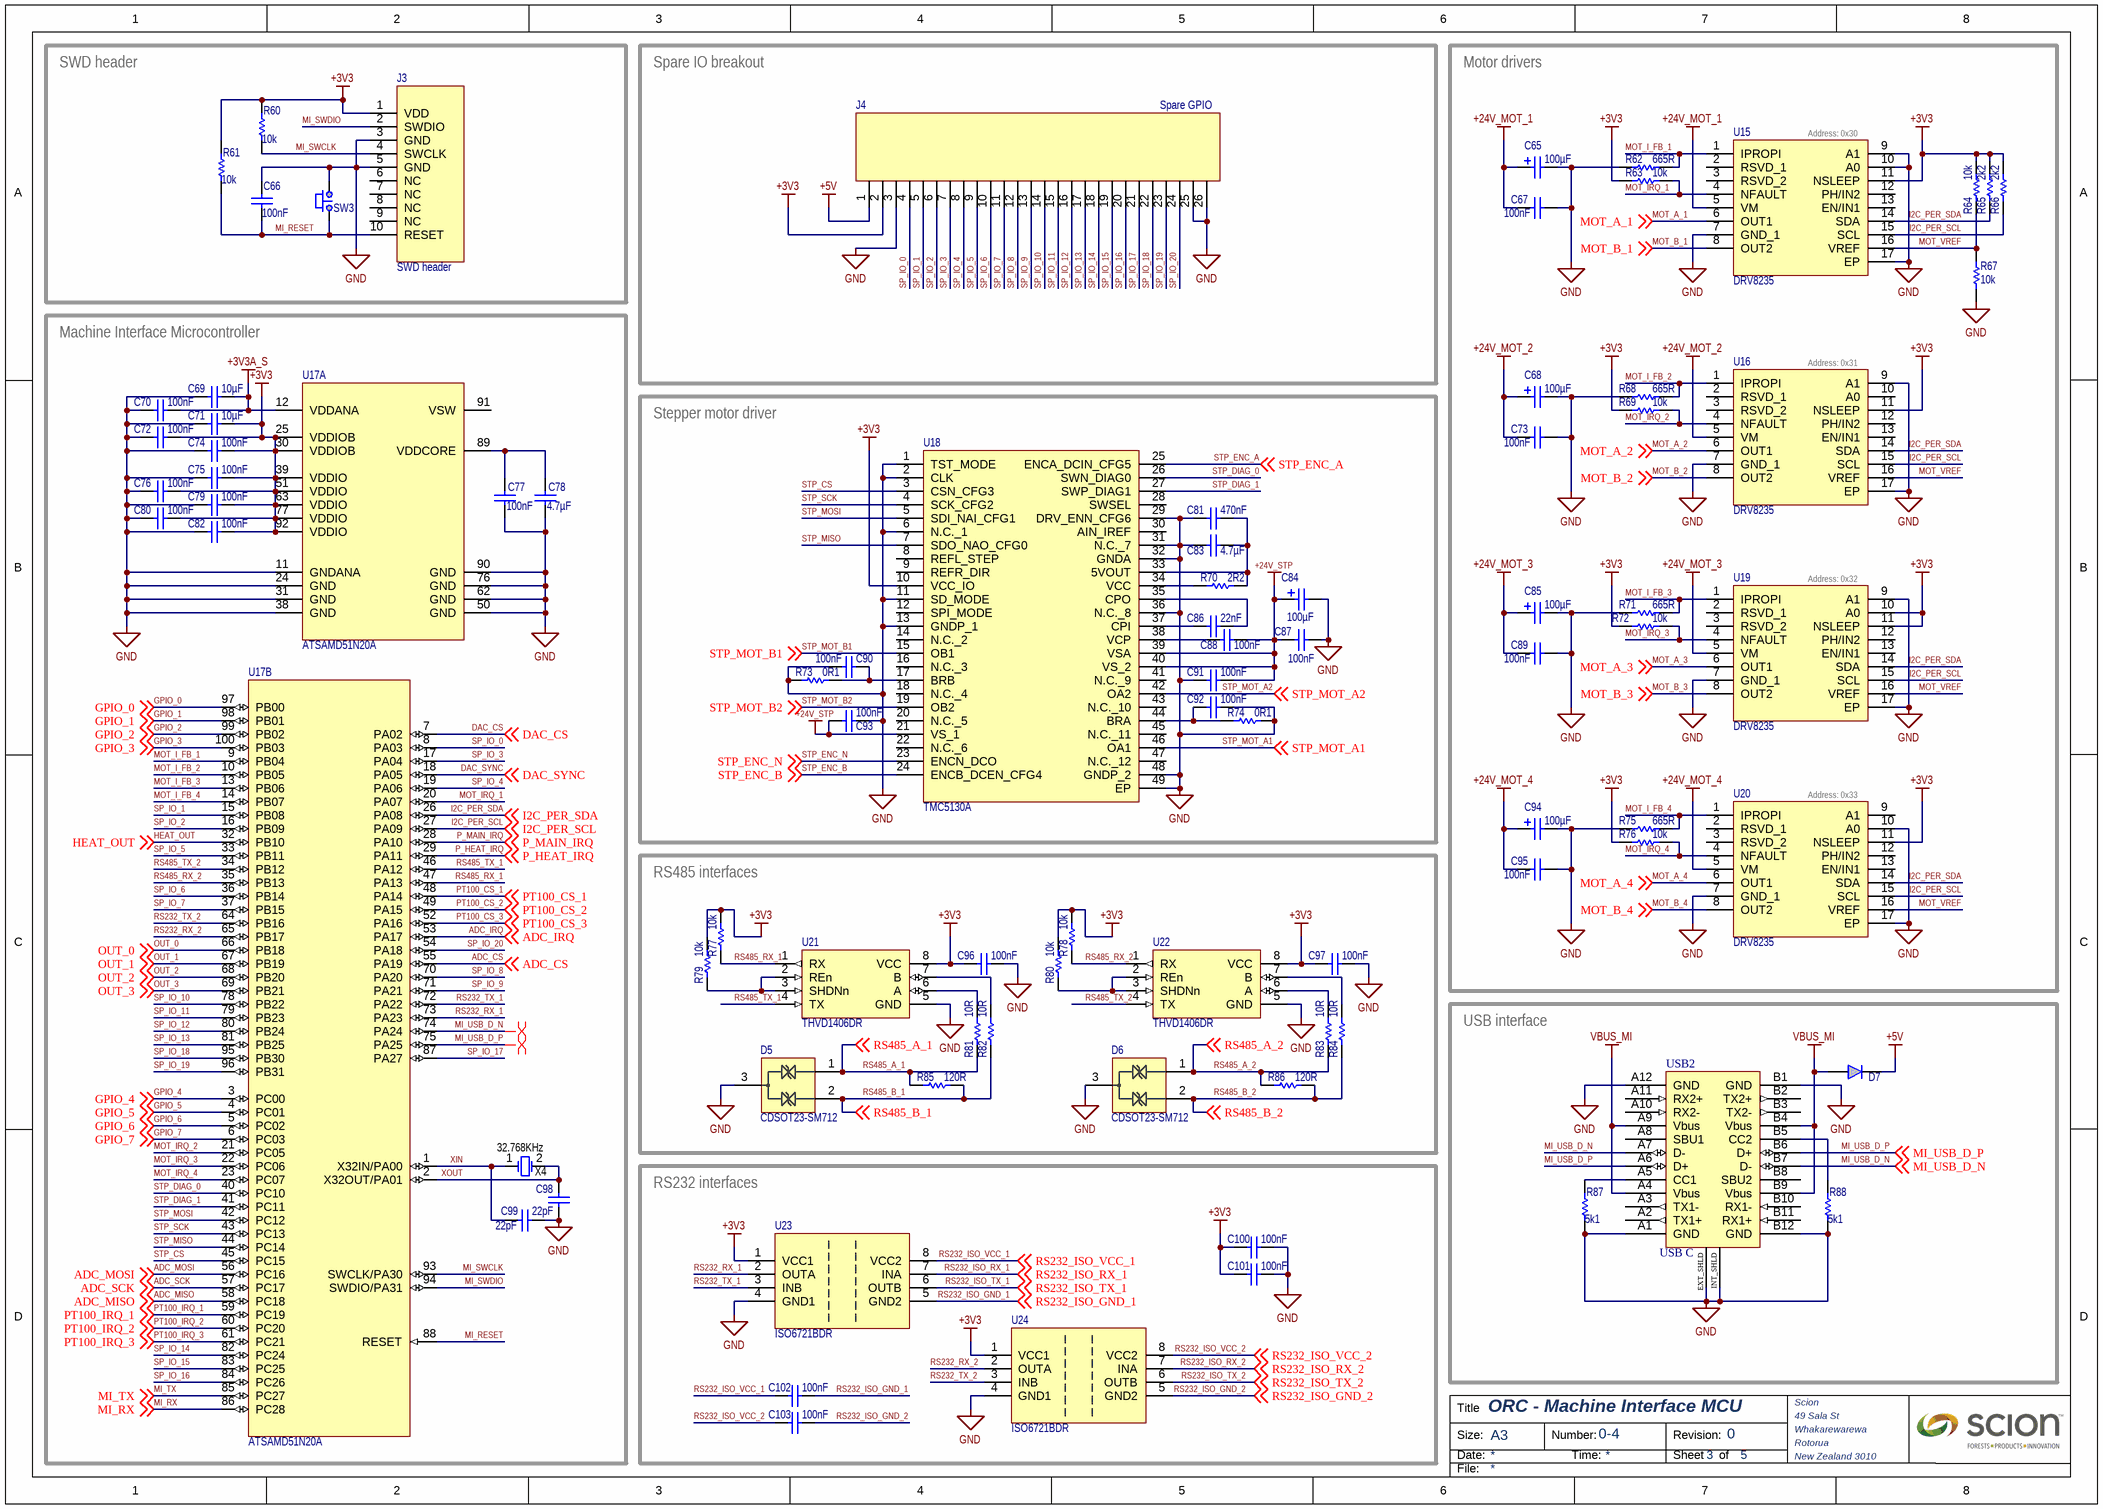
[diagram p2: Open Reactor Control System - Machine Interface MCU.SchDoc]

### Parts
C65  value 100µF  [CAP_PANA_F12_SIZE]  (hidden comment: Capacitor Electrolytic)
C66  value 100nF  [0603_CAP]  (hidden comment: Capacitor)
C67  value 100nF  [0603_CAP]  (hidden comment: Capacitor)
C68  value 100µF  [CAP_PANA_F12_SIZE]  (hidden comment: Capacitor Electrolytic)
C69  value 10µF  [0603_CAP]  (hidden comment: Capacitor)
C70  value 100nF  [0402_CAP]  (hidden comment: Capacitor)
C71  value 10µF  [0603_CAP]  (hidden comment: Capacitor)
C72  value 100nF  [0402_CAP]  (hidden comment: Capacitor)
C73  value 100nF  [0603_CAP]  (hidden comment: Capacitor)
C74  value 100nF  [0402_CAP]  (hidden comment: Capacitor)
C75  value 100nF  [0402_CAP]  (hidden comment: Capacitor)
C76  value 100nF  [0402_CAP]  (hidden comment: Capacitor)
C77  value 100nF  [0402_CAP]  (hidden comment: Capacitor)
C78  value 4.7µF  [0603_CAP]  (hidden comment: Capacitor)
C79  value 100nF  [0402_CAP]  (hidden comment: Capacitor)
C80  value 100nF  [0402_CAP]  (hidden comment: Capacitor)
C81  value 470nF  [0603_CAP]  (hidden comment: Capacitor)
C82  value 100nF  [0402_CAP]  (hidden comment: Capacitor)
C83  value 4.7µF  [0603_CAP]  (hidden comment: Capacitor)
C84  value 100µF  [CAP_PANA_F12_SIZE]  (hidden comment: Capacitor Electrolytic)
C85  value 100µF  [CAP_PANA_F12_SIZE]  (hidden comment: Capacitor Electrolytic)
C86  value 22nF  [0603_CAP]  (hidden comment: Capacitor)
C87  value 100nF  [0603_CAP]  (hidden comment: Capacitor)
C88  value 100nF  [0603_CAP]  (hidden comment: Capacitor)
C89  value 100nF  [0603_CAP]  (hidden comment: Capacitor)
C90  value 100nF  [0603_CAP]  (hidden comment: Capacitor)
C91  value 100nF  [0603_CAP]  (hidden comment: Capacitor)
C92  value 100nF  [0603_CAP]  (hidden comment: Capacitor)
C93  value 100nF  [0603_CAP]  (hidden comment: Capacitor)
C94  value 100µF  [CAP_PANA_F12_SIZE]  (hidden comment: Capacitor Electrolytic)
C95  value 100nF  [0603_CAP]  (hidden comment: Capacitor)
C96  value 100nF  [0603_CAP]  (hidden comment: Capacitor)
C97  value 100nF  [0603_CAP]  (hidden comment: Capacitor)
C98  value 22pF  [0402_CAP]  (hidden comment: Capacitor)
C99  value 22pF  [0402_CAP]  (hidden comment: Capacitor)
C100  value 100nF  [0603_CAP]  (hidden comment: Capacitor)
C101  value 100nF  [0603_CAP]  (hidden comment: Capacitor)
C102  value 100nF  [0603_CAP]  (hidden comment: Capacitor)
C103  value 100nF  [0603_CAP]  (hidden comment: Capacitor)
D5  CDSOT23-SM712  [FP-SOT23-IPC_C]
D6  CDSOT23-SM712  [FP-SOT23-IPC_C]
D7  Diode  [SOD-123]  (value not drawn)
J3  SWD header  [DIP10_1.27_M_SMD]
J4  Spare GPIO  [26_Pin DIL Male Header 2.54mm]
R60  value 10k  [0603_RES]  (hidden comment: Resistor)
R61  value 10k  [0603_RES]  (hidden comment: Resistor)
R62  value 665R  [0603_RES]  (hidden comment: Resistor)
R63  value 10k  [0603_RES]  (hidden comment: Resistor)
R64  value 10k  [0603_RES]  (hidden comment: Resistor)
R65  value 2k2  [0603_RES]  (hidden comment: Resistor)
R66  value 2k2  [0603_RES]  (hidden comment: Resistor)
R67  value 10k  [0603_RES]  (hidden comment: Resistor)
R68  value 665R  [0603_RES]  (hidden comment: Resistor)
R69  value 10k  [0603_RES]  (hidden comment: Resistor)
R70  value 2R2  [0603_RES]  (hidden comment: Resistor)
R71  value 665R  [0603_RES]  (hidden comment: Resistor)
R72  value 10k  [0603_RES]  (hidden comment: Resistor)
R73  value 0R1  [1206_RES]  (hidden comment: Resistor)
R74  value 0R1  [1206_RES]  (hidden comment: Resistor)
R75  value 665R  [0603_RES]  (hidden comment: Resistor)
R76  value 10k  [0603_RES]  (hidden comment: Resistor)
R77  value 10k  [0603_RES]  (hidden comment: Resistor)
R78  value 10k  [0603_RES]  (hidden comment: Resistor)
R79  value 10k  [0603_RES]  (hidden comment: Resistor)
R80  value 10k  [0603_RES]  (hidden comment: Resistor)
R81  value 10R  [0603_RES]  (hidden comment: Resistor)
R82  value 10R  [0603_RES]  (hidden comment: Resistor)
R83  value 10R  [0603_RES]  (hidden comment: Resistor)
R84  value 10R  [0603_RES]  (hidden comment: Resistor)
R85  value 120R  [0603_RES]  (hidden comment: Resistor)
R86  value 120R  [0603_RES]  (hidden comment: Resistor)
R87  value 5k1  [0603_RES]  (hidden comment: Resistor)
R88  value 5k1  [0603_RES]  (hidden comment: Resistor)
SW3  EVP-AAN02Q  [FP-EVP-AAN02Q-MFG]  (value not drawn)
U15  DRV8235  [DRV8235-Footprint-1]
U16  DRV8235  [DRV8235-Footprint-1]
U17  ATSAMD51N20A  [FP-C04-110-IPC_C]  (parts A,B of 2)
U18  TMC5130A  [TMC5130A-Footprint-1]
U19  DRV8235  [DRV8235-Footprint-1]
U20  DRV8235  [DRV8235-Footprint-1]
U21  THVD1406DR  [SOIC127P600X175-8N]
U22  THVD1406DR  [SOIC127P600X175-8N]
U23  ISO6721BDR  [SOIC127P600X175-8N]
U24  ISO6721BDR  [SOIC127P600X175-8N]
USB2  USB C  [GT-USB-7010ASV]
X4  32.768KHz  [ABRA-ABS07-2_V]

### Blocks framed on the sheet
SWD header: C66 J3 R60 R61 SW3
Spare IO breakout: J4
Motor drivers: C65 C67 C68 C73 C85 C89 C94 C95 R62-R69 R71 R72 R75 R76 U15 U16 U19 U20
Machine Interface Microcontroller: C69-C72 C74-C80 C82 C98 C99 U17 X4
Stepper motor driver: C81 C83 C84 C86-C88 C90-C93 R70 R73 R74 U18
RS485 interfaces: C96 C97 D5 D6 R77-R86 U21 U22
USB interface: D7 R87 R88 USB2
RS232 interfaces: C100-C103 U23 U24

### Nets
+3V3: C71.1 C72.1 C74.1 C75.1 C76.1 C79.1 C80.1 C82.1 C96.2 C97.2 C100.2 C101.2 J3.1(VDD) J4.2 R60.1 R61.1 R63.2 R64.2 R65.1 R66.1 R69.2 R72.2 R76.2 R77.1 R78.1 R79.1 R80.1 U15.11(NSLEEP) U16.11(NSLEEP) U17.25(VDDIOB) U17.30(VDDIOB) U17.39(VDDIO) U17.51(VDDIO) U17.63(VDDIO) U17.77(VDDIO) U17.92(VDDIO) U18.10(VCC_IO) U19.10(A0) U19.11(NSLEEP) U20.11(NSLEEP) U21.8(VCC) U22.8(VCC) U23.1(VCC1) U24.1(VCC1)
+3V3A_S: C69.1 C70.1 U17.12(VDDANA)
+5V: D7.1(K) J4.1
+24V_MOT_1: C65.1 C67.1 U15.5(VM)
+24V_MOT_2: C68.1 C73.1 U16.5(VM)
+24V_MOT_3: C85.1 C89.1 U19.5(VM)
+24V_MOT_4: C94.1 C95.1 U20.5(VM)
+24V_STP: C84.1 C87.1 C88.1 C91.2 C93.1 U18.21(VS_1) U18.39(VSA) U18.40(VS_2)
GND: C65.2 C66.1 C67.2 C68.2 C69.2 C70.2 C71.2 C72.2 C73.2 C74.2 C75.2 C76.2 C77.1 C78.1 C79.2 C80.2 C81.1 C82.2 C83.2 C84.2 C85.2 C87.2 C89.2 C90.1 C91.1 C92.2 C93.2 C94.2 C95.2 C96.1 C97.1 C98.2 C99.1 C100.1 C101.1 D5.3 D6.3 J3.3(GND) J3.5(GND) J4.3 J4.25 J4.26 R62.1 R67.1 R68.1 R71.1 R73.2 R74.1 R75.1 R87.2 R88.2 SW3.2 U15.7(GND_1) U15.9(A1) U15.10(A0) U15.17(EP) U16.7(GND_1) U16.9(A1) U16.17(EP) U17.11(GNDANA) U17.24(GND) U17.31(GND) U17.38(GND) U17.50(GND) U17.62(GND) U17.76(GND) U17.90(GND) U18.1(TST_MODE) U18.2(CLK) U18.6(N.C._1) U18.11(SD_MODE) U18.13(GNDP_1) U18.29(DRV_ENN_CFG6) U18.31(N.C._7) U18.32(GNDA) U18.36(N.C._8) U18.48(GNDP_2) U18.49(EP) U19.7(GND_1) U19.9(A1) U19.17(EP) U20.7(GND_1) U20.10(A0) U20.17(EP) U21.5(GND) U22.5(GND) U23.4(GND1) U24.4(GND1) USB2.A1(GND) USB2.A12(GND) USB2.B1(GND) USB2.B12(GND) USB2.EXT_SHLD USB2.INT_SHLD
VBUS_MI: D7.2(A) USB2.A4(Vbus) USB2.A9(Vbus) USB2.B4(Vbus) USB2.B9(Vbus)
ADC_CS: U17.55(PA19) ; off-sheet ADC_CS
ADC_IRQ: U17.53(PA17) ; off-sheet ADC_IRQ
ADC_MISO: U17.58(PC18) ; off-sheet ADC_MISO
ADC_MOSI: U17.56(PC16) ; off-sheet ADC_MOSI
ADC_SCK: U17.57(PC17) ; off-sheet ADC_SCK
DAC_CS: U17.7(PA02) ; off-sheet DAC_CS
DAC_SYNC: U17.18(PA05) ; off-sheet DAC_SYNC
GPIO_0: U17.97(PB00) ; off-sheet GPIO_0
GPIO_1: U17.98(PB01) ; off-sheet GPIO_1
GPIO_2: U17.99(PB02) ; off-sheet GPIO_2
GPIO_3: U17.100(PB03) ; off-sheet GPIO_3
GPIO_4: U17.3(PC00) ; off-sheet GPIO_4
GPIO_5: U17.4(PC01) ; off-sheet GPIO_5
GPIO_6: U17.5(PC02) ; off-sheet GPIO_6
GPIO_7: U17.6(PC03) ; off-sheet GPIO_7
HEAT_OUT: U17.32(PB10) ; off-sheet HEAT_OUT
I2C_PER_SCL: R66.2 U15.15(SCL) U16.15(SCL) U17.27(PA09) U19.15(SCL) U20.15(SCL) ; off-sheet I2C_PER_SCL
I2C_PER_SDA: R65.2 U15.14(SDA) U16.14(SDA) U17.26(PA08) U19.14(SDA) U20.14(SDA) ; off-sheet I2C_PER_SDA
MI_RESET: C66.2 J3.10(RESET) R61.2 SW3.1 U17.88(RESET)
MI_RX: U17.86(PC28) ; off-sheet MI_RX
MI_SWCLK: J3.4(SWCLK) R60.2 U17.93(SWCLK/PA30)
MI_SWDIO: J3.2(SWDIO) U17.94(SWDIO/PA31)
MI_TX: U17.85(PC27) ; off-sheet MI_TX
MI_USB_D_N: U17.74(PA24) USB2.A7(D-) USB2.B7(D-) ; off-sheet MI_USB_D_N
MI_USB_D_P: U17.75(PA25) USB2.A6(D+) USB2.B6(D+) ; off-sheet MI_USB_D_P
MOT_A_1: U15.6(OUT1) ; off-sheet MOT_A_1
MOT_A_2: U16.6(OUT1) ; off-sheet MOT_A_2
MOT_A_3: U19.6(OUT1) ; off-sheet MOT_A_3
MOT_A_4: U20.6(OUT1) ; off-sheet MOT_A_4
MOT_B_1: U15.8(OUT2) ; off-sheet MOT_B_1
MOT_B_2: U16.8(OUT2) ; off-sheet MOT_B_2
MOT_B_3: U19.8(OUT2) ; off-sheet MOT_B_3
MOT_B_4: U20.8(OUT2) ; off-sheet MOT_B_4
MOT_I_FB_1: R62.2 U15.1(IPROPI) U17.9(PB04)
MOT_I_FB_2: R68.2 U16.1(IPROPI) U17.10(PB05)
MOT_I_FB_3: R71.2 U17.13(PB06) U19.1(IPROPI)
MOT_I_FB_4: R75.2 U17.14(PB07) U20.1(IPROPI)
MOT_IRQ_1: R63.1 U15.4(NFAULT) U17.20(PA07)
MOT_IRQ_2: R69.1 U16.4(NFAULT) U17.21(PC05)
MOT_IRQ_3: R72.1 U17.22(PC06) U19.4(NFAULT)
MOT_IRQ_4: R76.1 U17.23(PC07) U20.4(NFAULT)
MOT_VREF: R64.1 R67.2 U15.16(VREF) U16.16(VREF) U19.16(VREF) U20.16(VREF)
OUT_0: U17.66(PB18) ; off-sheet OUT_0
OUT_1: U17.67(PB19) ; off-sheet OUT_1
OUT_2: U17.68(PB20) ; off-sheet OUT_2
OUT_3: U17.69(PB21) ; off-sheet OUT_3
P_HEAT_IRQ: U17.29(PA11) ; off-sheet P_HEAT_IRQ
P_MAIN_IRQ: U17.28(PA10) ; off-sheet P_MAIN_IRQ
PT100_CS_1: U17.48(PA14) ; off-sheet PT100_CS_1
PT100_CS_2: U17.49(PA15) ; off-sheet PT100_CS_2
PT100_CS_3: U17.52(PA16) ; off-sheet PT100_CS_3
PT100_IRQ_1: U17.59(PC19) ; off-sheet PT100_IRQ_1
PT100_IRQ_2: U17.60(PC20) ; off-sheet PT100_IRQ_2
PT100_IRQ_3: U17.61(PC21) ; off-sheet PT100_IRQ_3
RS232_ISO_GND_1: C102.1 U23.5(GND2) ; off-sheet RS232_ISO_GND_1
RS232_ISO_GND_2: C103.1 U24.5(GND2) ; off-sheet RS232_ISO_GND_2
RS232_ISO_RX_1: U23.7(INA) ; off-sheet RS232_ISO_RX_1
RS232_ISO_RX_2: U24.7(INA) ; off-sheet RS232_ISO_RX_2
RS232_ISO_TX_1: U23.6(OUTB) ; off-sheet RS232_ISO_TX_1
RS232_ISO_TX_2: U24.6(OUTB) ; off-sheet RS232_ISO_TX_2
RS232_ISO_VCC_1: C102.2 U23.8(VCC2) ; off-sheet RS232_ISO_VCC_1
RS232_ISO_VCC_2: C103.2 U24.8(VCC2) ; off-sheet RS232_ISO_VCC_2
RS232_RX_1: U17.73(PA23) U23.2(OUTA)
RS232_RX_2: U17.65(PB17) U24.2(OUTA)
RS232_TX_1: U17.72(PA22) U23.3(INB)
RS232_TX_2: U17.64(PB16) U24.3(INB)
RS485_A_1: D5.1 R81.1 R85.1 ; off-sheet RS485_A_1
RS485_A_2: D6.1 R83.1 R86.1 ; off-sheet RS485_A_2
RS485_B_1: D5.2 R82.1 R85.2 ; off-sheet RS485_B_1
RS485_B_2: D6.2 R84.1 R86.2 ; off-sheet RS485_B_2
RS485_RX_1: R77.2 U17.47(PA13) U21.1(RX)
RS485_RX_2: R78.2 U17.35(PB13) U22.1(RX)
RS485_TX_1: U17.46(PA12) U21.4(TX)
RS485_TX_2: U17.34(PB12) U22.4(TX)
SP_IO_0: J4.4 U17.8(PA03)
SP_IO_1: J4.5 U17.15(PB08)
SP_IO_2: J4.6 U17.16(PB09)
SP_IO_3: J4.7 U17.17(PA04)
SP_IO_4: J4.8 U17.19(PA06)
SP_IO_5: J4.9 U17.33(PB11)
SP_IO_6: J4.10 U17.36(PB14)
SP_IO_7: J4.11 U17.37(PB15)
SP_IO_8: J4.12 U17.70(PA20)
SP_IO_9: J4.13 U17.71(PA21)
SP_IO_10: J4.14 U17.78(PB22)
SP_IO_11: J4.15 U17.79(PB23)
SP_IO_12: J4.16 U17.80(PB24)
SP_IO_13: J4.17 U17.81(PB25)
SP_IO_14: J4.18 U17.82(PC24)
SP_IO_15: J4.19 U17.83(PC25)
SP_IO_16: J4.20 U17.84(PC26)
SP_IO_17: J4.21 U17.87(PA27)
SP_IO_18: J4.22 U17.95(PB30)
SP_IO_19: J4.23 U17.96(PB31)
SP_IO_20: J4.24 U17.54(PA18)
STP_CS: U17.45(PC15) U18.3(CSN_CFG3)
STP_DIAG_0: U17.40(PC10) U18.26(SWN_DIAG0)
STP_DIAG_1: U17.41(PC11) U18.27(SWP_DIAG1)
STP_ENC_A: U18.25(ENCA_DCIN_CFG5) ; off-sheet STP_ENC_A
STP_ENC_B: U18.24(ENCB_DCEN_CFG4) ; off-sheet STP_ENC_B
STP_ENC_N: U18.23(ENCN_DCO) ; off-sheet STP_ENC_N
STP_MISO: U17.44(PC14) U18.7(SDO_NAO_CFG0)
STP_MOSI: U17.42(PC12) U18.5(SDI_NAI_CFG1)
STP_MOT_A1: U18.46(OA1) ; off-sheet STP_MOT_A1
STP_MOT_A2: U18.42(OA2) ; off-sheet STP_MOT_A2
STP_MOT_B1: U18.15(OB1) ; off-sheet STP_MOT_B1
STP_MOT_B2: U18.19(OB2) ; off-sheet STP_MOT_B2
STP_SCK: U17.43(PC13) U18.4(SCK_CFG2)
XIN: C99.2 U17.1(X32IN/PA00) X4.1(OSC1)
XOUT: C98.1 U17.2(X32OUT/PA01) X4.2(OSC2)
NetC77_2: C77.2 C78.2 U17.89(VDDCORE)
NetC81_2: C81.2 C83.1 R70.1 U18.33(5VOUT)
NetC86_1: C86.1 U18.37(CPI)
NetC86_2: C86.2 U18.35(CPO)
NetC88_2: C88.2 U18.38(VCP)
NetC90_2: C90.2 R73.1 U18.17(BRB)
NetC92_1: C92.1 R74.2 U18.44(BRA)
NetR70_2: R70.2 U18.34(VCC)
NetR79_2: R79.2 U21.2(REn) U21.3(SHDNn)
NetR80_2: R80.2 U22.2(REn) U22.3(SHDNn)
NetR81_2: R81.2 U21.6(A)
NetR82_2: R82.2 U21.7(B)
NetR83_2: R83.2 U22.6(A)
NetR84_2: R84.2 U22.7(B)
NetR87_1: R87.1 USB2.A5(CC1)
NetR88_1: R88.1 USB2.B5(CC2)

Not connected (* = marked no-connect by the designer): J3 6(NC) 7(NC) 8(NC) 9(NC); U15 2(RSVD_1) 3(RSVD_2) 12(PH/IN2) 13(EN/IN1); U16 2(RSVD_1) 3(RSVD_2) 10(A0) 12(PH/IN2) 13(EN/IN1); U17 91(VSW); U18 8(REFL_STEP) 9(REFR_DIR) 12(SPI_MODE) 14(N.C._2) 16(N.C._3) 18(N.C._4) 20(N.C._5) 22(N.C._6) 28(SWSEL) 30(AIN_IREF) 41(N.C._9) 43(N.C._10) 45(N.C._11) 47(N.C._12); U19 2(RSVD_1) 3(RSVD_2) 12(PH/IN2) 13(EN/IN1); U20 2(RSVD_1) 3(RSVD_2) 9(A1) 12(PH/IN2) 13(EN/IN1); USB2 A2(TX1+) A3(TX1-) A8(SBU1) A10(RX2-) A11(RX2+) B2(TX2+) B3(TX2-) B8(SBU2) B10(RX1-) B11(RX1+)

### Layout directives
differential pair: MI_USB_D_N, MI_USB_D_P

### Notes on the sheet
- (near U15) Address: 0x30
- (near U16) Address: 0x31
- (near U19) Address: 0x32
- (near U20) Address: 0x33
- Title
- Size:
- Date:
- A3
- Number:
- Time:
- Revision:
- Sheet
- of
- File:

### Library data of the parts
C65 C68 C84 C85 C94 = CMP-001-00173-1: SMD Electrolytic Capacitor; Pins: 2; Component Type: Standard; MFN: *; Source: Discrete.SchLib; Design Item ID: Capacitor Electrolytic
C66 C67 C69-C83 C86-C93 C95-C103 = CMP-001-00172-2: SMD Capacitor; Pins: 2; Source: Discrete.SchLib; Design Item ID: Capacitor; Component Type: Standard
D5 D6 = CDSOT23-SM712-3: Trans Voltage Suppressor Diode, 400W, 7V V(RWM), Bidirectional, 2 Element, Silicon; Number of Elements: 2; Min Breakdown Voltage: 7.5V; Qualification Status: Not Qualified; Clamping Voltage-Max: 19V; Reference Standard: IEC-61000-4-2; Package Body Material: Plastic; Technology: AVALANCHE; JESD-30 Code: R-PDSO-G3; Moisture Sensitivity Level: 1; Polarity: Bidirectional; Diode Element Material: SILICON; Rep Pk Reverse Voltage-Max: 7V; JESD-609 Code: e3; Non-rep Peak Rev Power Dis-Max: 400W; Diode Type: TRANS VOLTAGE SUPPRESSOR; Package Style: SMALL OUTLINEMeter; Pins: 3; Surface Mount: Yes; Breakdown Voltage-Nom: 7.5V; Reach SVHC Compliant: Yes; Package Shape: Rectangular; Terminal Form: Gull Wing; RoHS Compliant: Yes; Terminal Position: DUAL; Terminal Finish: Tin
D7 = CMP-004-00083-4: SMD Diode; Design Item ID: Diode; Pins: 2; Source: Discrete.SchLib; Component Type: Standard; Pin Count: 2
J3 = CMP-002-00170-1: 10 Pin Connector; Component Type: Standard; Pins: 10; Source: Connectors.SchLib; Pin Count: 10; Design Item ID: 10_Pin
J4 = CMP-002-00004-1: 26 Pin Connector; Design Item ID: 30_Pin; Component Type: Standard; Source: Connectors.SchLib; Pin Count: 30; Pins: 32
R60-R86 = CMP-009-00356-1: SMD Resistor; Pins: 2; Source: Discrete.SchLib; Component Type: Standard; Design Item ID: Resistor
R87 R88 = CMP-009-00356-1: SMD Resistor; Value: 5k1; Pins: 2; Source: Discrete.SchLib; Component Type: Standard; Design Item ID: Resistor
SW3 = CMP-011-00000-2: as SW1 on sheet Open Reactor Control System - System Interface MCU
U15 U16 U19 U20 = CMP-00024-00001-1: Motor/Motion/Ignition Controllers & Drivers 38V 3.7A brushed DC motor driver with integrated speed regulation and stall detection
U17 = CMP-020-00002-2: RISC Microcontroller, 32-Bit, FLASH, 120MHz, CMOS, PQFP100
U18 = CMP-00024-00000-1: Universal high voltage controller/driver for two-phase bipolar stepper motor. StealthChop™ for quiet movement. Integrated MOSFETs for up to 2 A motor current per coil. With Step/Dir Interface and SPI.
U21 U22 = CMP-015-00008-1: Line Transceiver, 1 Func, 1 Driver, 1 Rcvr, PDSO8; RoHS Compliant: Yes
U23 U24 = CMP-015-00010-1: Interface Circuit, CMOS, PDSO8
USB2 = CMP-079-000004-4: as USB1 on sheet Open Reactor Control System - System Interface MCU; Pin Count: 26; Design Item ID: CMP-00005-5; Source: All Components - 30.06.23 - 18.27.SchLib; Component Type: Standard
X4 = CMP-003-00061-3: as X3 on sheet Open Reactor Control System - System Interface MCU; Case/Package: CSMD; Datasheet Version: Aug-15; Pins: 2; Max Operating Temperature: 85°C; Package Description: 2-Pin Surface Mount Device, Body 3.2 x 1.5 mm; Manufacturer URL: http://www.abracon.com/; Package URL: http://www.abracon.com/Support/PackageDrawing/Resonators/ABS07.PDF; Min Operating Temperature: -40°C; Packaging: TapeandReel; RoHS Compliant: True; Package Reference: ABS07-2; Frequency Tolerance: 20ppm; Frequency: 32.768kHz; Datasheet URL: http://www.abracon.com/Resonators/ABS07.pdf; Package Quantity: 3000; Mounting Technology: SM; Component Type: Standard; Source: All Components - 30.06.23 - 18.27.SchLib; Design Item ID: CMP-003-00022-1